# Altium schematic sheet 02_INPUTS.SchDoc
size A3; DocumentNumber: 2; SheetNumber: 2; SheetTotal: 5
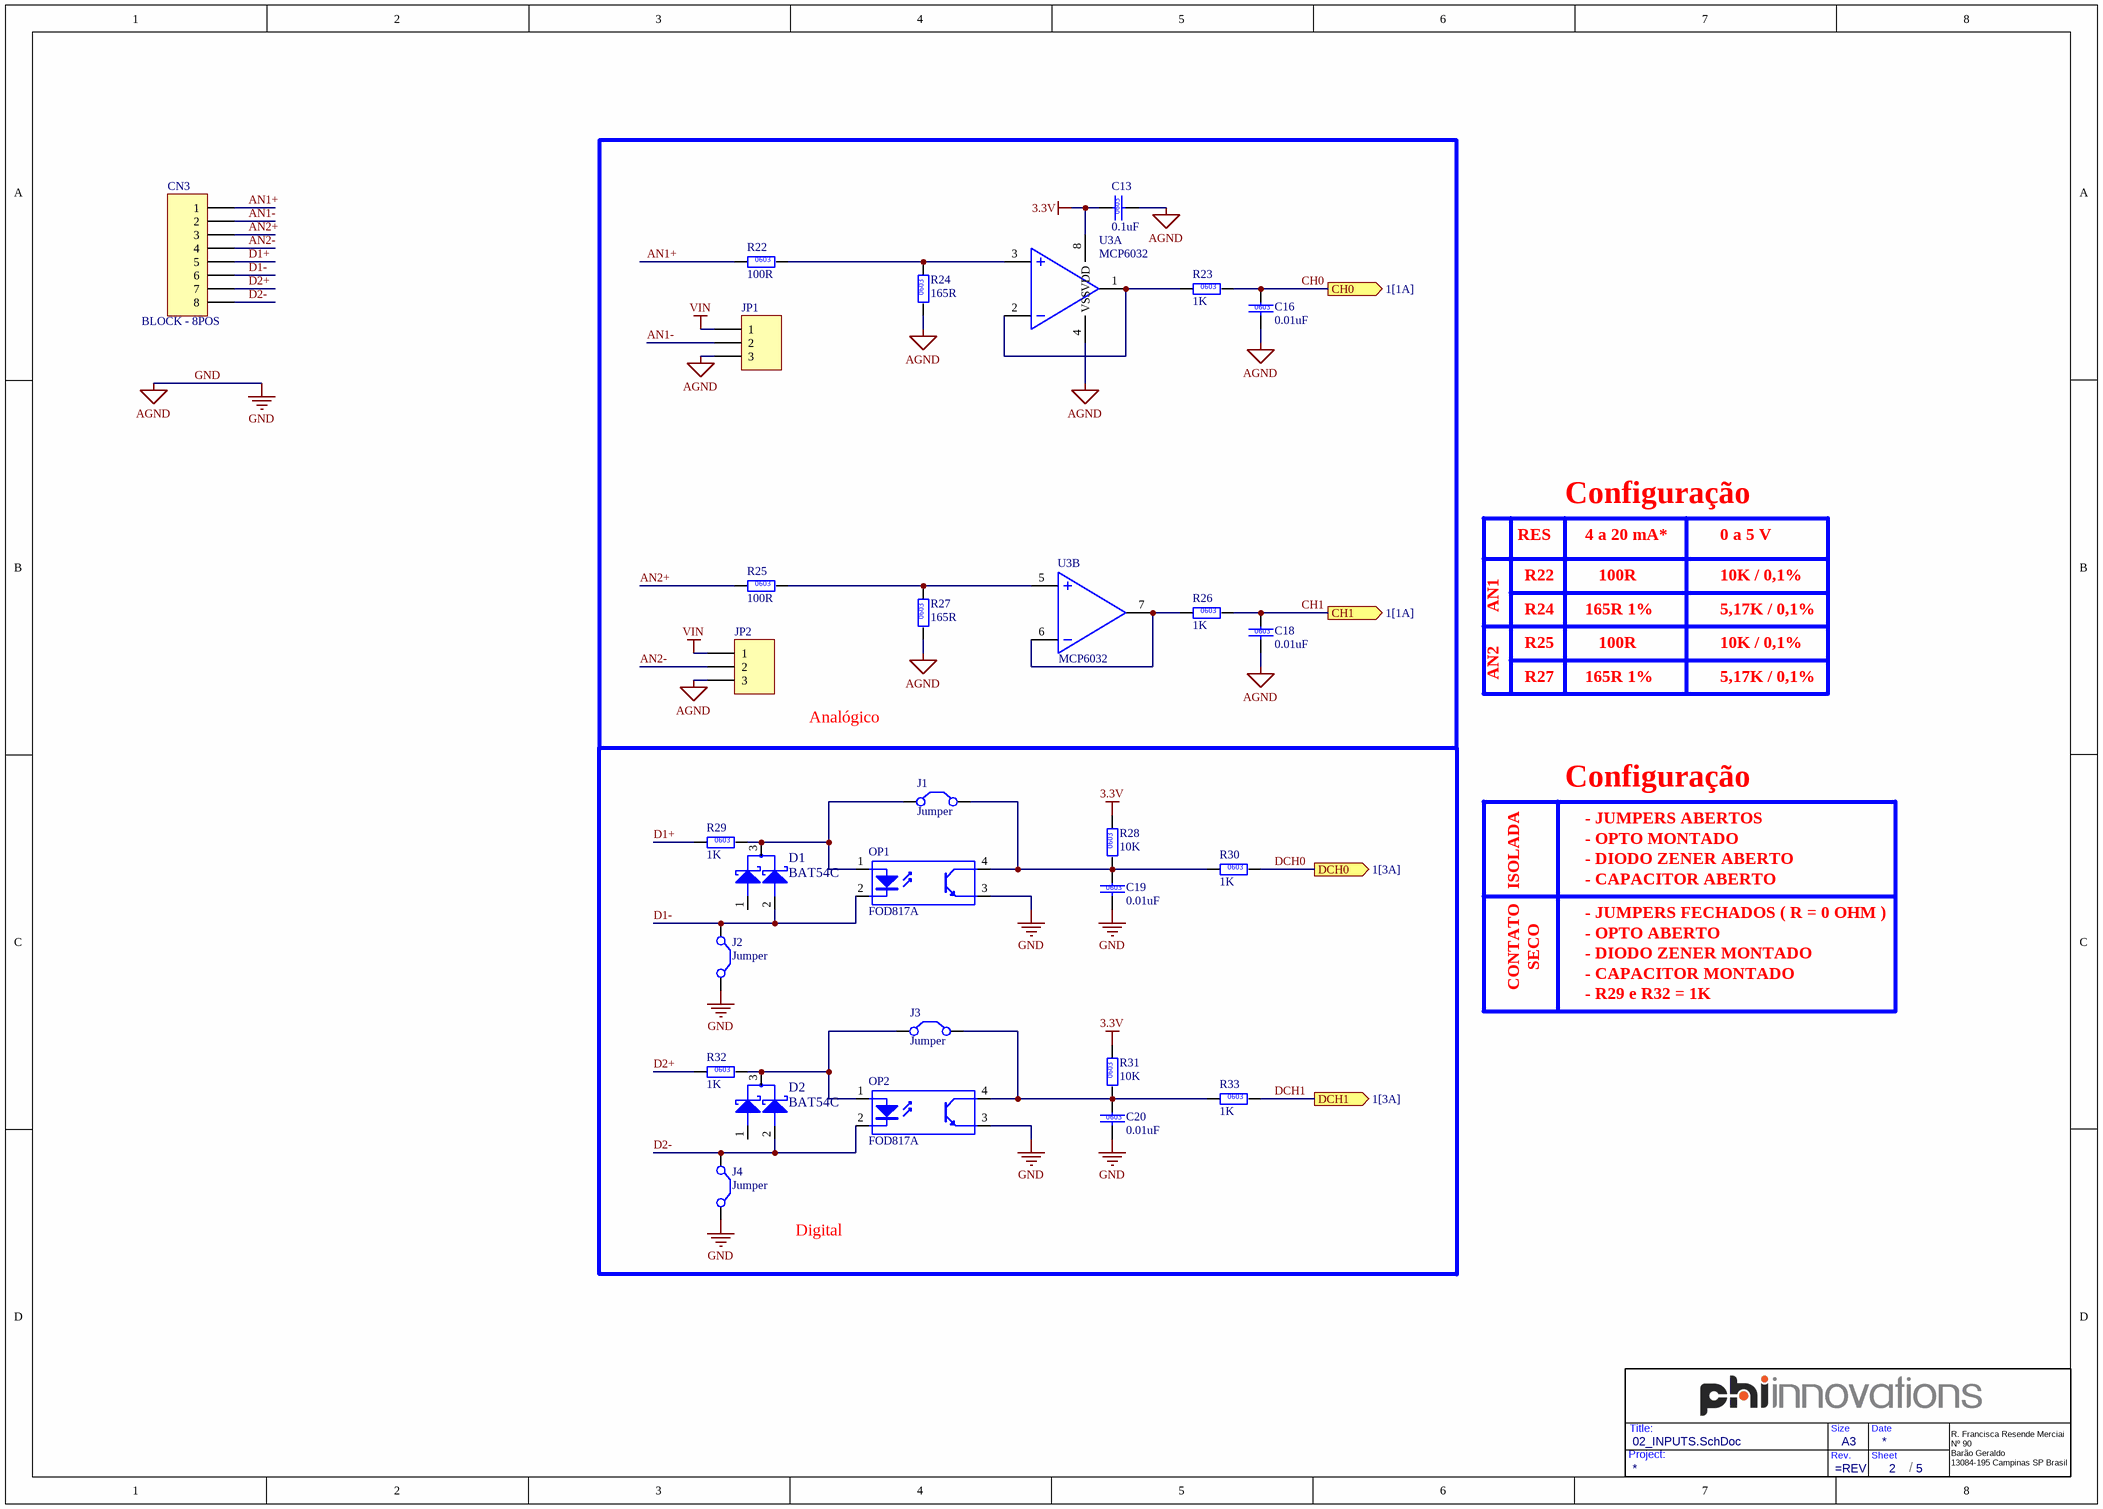
[diagram p0: 02_INPUTS.SchDoc]

## Parts
?  (no value)  (graphical)
C13  0.1uF  [0603C]
C16  0.01uF  [0603C]
C18  0.01uF  [0603C]
C19  0.01uF  [0603C]
C20  0.01uF  [0603C]
CN3  BLOCK - 8POS  [CONN_BORNE_3.81_8POS]
D1  BAT54C  [SOT-23-3]
D2  BAT54C  [SOT-23-3]
J1  Jumper  [HDR1X2]
J2  Jumper  [HDR1X2]
J3  Jumper  [HDR1X2]
J4  Jumper  [HDR1X2]
JP1  (no value)  [HDR1X3]
JP2  (no value)  [HDR1X3]
OP1  FOD817A  [OP SMD]
OP2  FOD817A  [OP SMD]
R22  100R  [0603R]
R23  1K  [0603R]
R24  165R  [0603R]
R25  100R  [0603R]
R26  1K  [0603R]
R27  165R  [0603R]
R28  10K  [0603R]
R29  1K  [0603R]
R30  1K  [0603R]
R31  10K  [0603R]
R32  1K  [0603R]
R33  1K  [0603R]
U3  MCP6032  [SOIC8]  (parts A,B of 2)

## Blocks framed on the sheet
Analógico: C13 C16 C18 JP1 JP2 R22-R27 U3
Digital: C19 C20 D1 D2 J1-J4 OP1 OP2 R28-R33

## Ports
CH0 (out, see 1[1A]), CH1 (out, see 1[1A]), DCH0 (out, see 1[3A]), DCH1 (out, see 1[3A])

## Nets
3.3V: C13.1 R28.2 R31.2 U3.8(VDD)
GND: C13.2 C16.2 C18.2 C19.2 C20.2 J2.2(C2) J4.2(C2) JP1.3 JP2.3 OP1.3(E) OP2.3(E) R24.1 R27.1 U3.4(VSS)  [also labelled AGND]
VIN: JP1.1 JP2.1
AN1+: CN3.1 R22.1
AN1-: CN3.2 JP1.2
AN2+: CN3.3 R25.1
AN2-: CN3.4 JP2.2
CH0: C16.1 R23.2 ; port CH0
CH1: C18.1 R26.2 ; port CH1
D1+: CN3.5 R29.1
D1-: CN3.6 D1.2(ANODE2) J2.1(C1) OP1.2(K)
D2+: CN3.7 R32.1
D2-: CN3.8 D2.2(ANODE2) J4.1(C1) OP2.2(K)
DCH0: R30.2 ; port DCH0
DCH1: R33.2 ; port DCH1
NetC19_1: C19.1 J1.2(C2) OP1.4(C) R28.1 R30.1
NetC20_1: C20.1 J3.2(C2) OP2.4(C) R31.1 R33.1
NetD1_3: D1.3(CATHODE) J1.1(C1) OP1.1(A) R29.2
NetD2_3: D2.3(CATHODE) J3.1(C1) OP2.1(A) R32.2
NetR22_2: R22.2 R24.2 U3.3(VINA+)
NetR23_1: R23.1 U3.1(VOUTA) U3.2(VINA-)
NetR25_2: R25.2 R27.2 U3.5(VINB+)
NetR26_1: R26.1 U3.6(VINB-) U3.7(VOUTB)

Not connected (* = marked no-connect by the designer): D1 1(ANODE1); D2 1(ANODE1)

## Notes on the sheet
- Configuração
- RES
- R22
- 4 a 20 mA*
- 100R
- 0 a 5 V
- 10K / 0,1%
- AN1
- R24
- R25
- 165R 1%
- 5,17K / 0,1%
- AN2
- R27
- - JUMPERS ABERTOS
- - OPTO MONTADO
- ISOLADA
- - DIODO ZENER ABERTO
- - CAPACITOR ABERTO
- - JUMPERS FECHADOS ( R = 0 OHM )
- CONTATO
- SECO
- - OPTO ABERTO
- - DIODO ZENER MONTADO
- - CAPACITOR MONTADO
- - R29 e R32 = 1K
- Project:
- Title:
- Rev.
- Size
- Sheet
- Date
- /
- R. Francisca Resende Merciai
  Nº 90
  Barão Geraldo
  13084-195 Campinas SP Brasil
- (in symbol PHI100.0.0603.100R.001.1/10W) 0603
- (in symbol PHI100.0.0603.165R.001.1/10W) 0603
- (in symbol PHI201.0.0603.000u1.005.050V.X7R) 0603
- (in symbol PHI201.0.0603.00u01.010.050V.X7R) 0603
- (in symbol RES0603) 0603

## Library data of the parts
? = Title_Block3
C13 = PHI201.0.0603.000u1.005.050V.X7R: CAP0603; Partnumber fabricante 1: 06035C104JAT2A; Fabricante 1: AVX Corporation; P Description: Capacitor ceramico 0603 0.1uF 20% 50V X7R; SCH Info: IOs; Datasheet fabricante 1: http://datasheets.avx.com/X7RDielectric.pdf; Distribuidor 1: Digi Key; Distribuidor 2: Mouser; Partnumber PHI: PHI201.0.0603.000u1.005.050V.X7R; PN distribuidor 1 / Fab 1: 478-5778-1-ND; Value: 0.1uF
C16 C18-C20 = PHI201.0.0603.00u01.010.050V.X7R: CAP0603; Partnumber fabricante 1: C0603C103K5RACTU; Fabricante 1: Kemet; P Description: Capacitor ceramico 0603 10000pF 10% 50V X7R; SCH Info: IOs; Partnumber PHI: PHI201.0.0603.00u01.010.050V.X7R; Datasheet fabricante 1: http://www.kemet.com/docfinder?Partnumber=C0603C103K5RACTU; Distribuidor 1: Digi Key; PN distribuidor 1 / Fab 1: 399-1091-1-ND; Distribuidor 2: Mouser; Value: 0.01uF
CN3 = PHI740.1.M.OSTOQ083251: HEADER_8; Fabricante 1: On Shore Technology Inc.; P Description: TERM BLOCK HDR 8POS 90DEG 3.81MM; SCH Info: IOs; Partnumber PHI: PHI740.1.M.OSTOQ083251; Partnumber fabricante 1: OSTOQ083251; Datasheet fabricante 1: http://www.on-shore.com/wp-content/uploads/2015/09/ostoqxx3251.pdf; Distribuidor 1: Digi Key; PN distribuidor 1 / Fab 1: ED2814-ND; Distribuidor 2: Mouser; Value: BLOCK - 8POS
D1 D2 = PHI420.0.BAT54C-7-F: BAT54C-7-F; Fabricante 1: Diodes Incorporated; P Description: Diodo Array Schottky Small Sig SOT-23-3 30V 1 Pair Common Cathode; SCH Info: IOs; Partnumber PHI: PHI420.0.BAT54C-7-F; Partnumber fabricante 1: BAT54C-7-F; Datasheet fabricante 1: http://www.diodes.com/_files/datasheets/ds11005.pdf; Distribuidor 1: Digi Key; PN distribuidor 1 / Fab 1: BAT54C-FDICT-ND; Distribuidor 2: Mouser; Value: BAT54C
J1-J4 = Jumper: Jumper Wire; Partnumber fabricante 1: Header 2.54mm; SCH Info: IOs
JP1 JP2 = Header 3: Header, 3-Pin; Partnumber fabricante 1: Header 2.54mm; SCH Info: IOs
OP1 OP2 = PHI800.0.FOD817A3SD: OPTOISOLATOR 5KV TRANSISTOR 4SMD; Fabricante 1: Fairchild Semiconductor; SCH Info: IOs; Partnumber PHI: PHI800.0.FOD817A3SD; Partnumber fabricante 1: FOD817A3SD; Datasheet fabricante 1: http://www.fairchildsemi.com/datasheets/FO/FOD817A.pdf; Distribuidor 1: Digi Key; PN distribuidor 1 / Fab 1: FOD817A3SDCT-ND; Distribuidor 2: Mouser; P Description: OPTOISOLATOR 5KV TRANSISTOR 4SMD; Value: FOD817A
R22 R25 = PHI100.0.0603.100R.001.1/10W: RES0603; Partnumber fabricante 1: RC0603FR-07100RL; Fabricante 1: Yageo; P Description: Resistor SMD 0603 100R 1% 1/16W; Partnumber PHI: PHI100.0.0603.100R.001.1/10W; Datasheet fabricante 1: http://www.yageo.com.tw/exep/pages/download/literatures/PYu-R_INT-thick_7.pdf; Distribuidor 1: Digi Key; PN distribuidor 1 / Fab 1: 311-100HRCT-ND; Distribuidor 2: Mouser; Value: 100R
R23 R26 R29 R30 R32 R33 = RES0603: Resistor 0603 1K; Part Number: RES_0603_1%_1K; Partnumber fabricante 1: RC0603FR-071KL; Partnumber PHI: PHI100.0.0603.001K.001.1/10W; Fabricante 1: Yageo; P Description: Resistor SMD 0603 1K 1% 1/10W; Fabricante 2: Panasonic Electronic Components; SCH Info: IOs; Supplier 1: Digi-Key; Supplier Part Number 1: 311-1.00KHRCT-ND; Datasheet fabricante 1: http://www.yageo.com/NewPortal/yageodocoutput?fileName=/pdf/R-Chip/PYu-RC_Group_51_RoHS_L_3.pdf; Distribuidor 1: Digi Key; Distribuidor 2: Mouser; PN distribuidor 1 / Fab 1: 311-1.00KHRCT-ND; Value: 1K; Datasheet fabricante 2: http://industrial.panasonic.com/www-cgi/jvcr13pz.cgi?E+PZ+3+AOA0002+ERJ3EKF1001V+7+WW; Partnumber fabricante 2: ERJ-3EKF1001V; PN distribuidor 1 / Fab 2: P1.00KHCT-ND
R24 R27 = PHI100.0.0603.165R.001.1/10W: RES0603; Partnumber fabricante 1: RC0603FR-07165RL; Fabricante 1: Yageo; P Description: Resistor SMD 0603 165R 1% 1/16W; Partnumber PHI: PHI100.0.0603.165R.001.1/10W; Datasheet fabricante 1: http://www.yageo.com.tw/exep/pages/download/literatures/PYu-R_INT-thick_7.pdf; Distribuidor 1: Digi Key; PN distribuidor 1 / Fab 1: 311-165HRCT-ND; Distribuidor 2: Mouser; Value: 165R
R28 R31 = RES0603: Part Number: RES_0603_1%_10k; Partnumber fabricante 1: RC0603FR-0710KL; Partnumber PHI: PHI101.0.0603.010K.001.1/10W; Fabricante 1: Yageo; P Description: Resistor SMD 0603 10K 1% 1/08W; Fabricante 2: Stackpole Electronics Inc; SCH Info: IOs; Supplier 1: Digi-Key; Supplier Part Number 1: 311-10.0KHRCT-ND; Datasheet fabricante 1: http://www.yageo.com/documents/recent/PYu-RC_Group_51_RoHS_L_04.pdf; Distribuidor 1: Digi Key; Distribuidor 2: Mouser; PN distribuidor 1 / Fab 1: 311-10.0KHRCT-ND; Value: 10K; Datasheet fabricante 2: http://www.seielect.com/catalog/SEI-RNCP.pdf; Partnumber fabricante 2: RNCP0603FTD10K0; PN distribuidor 1 / Fab 2: RMCF0603FT10K0CT-ND
U3 = PHI800.0.MCP6032-E/SN: Fabricante 1: Microchip Technology; P Description: IC OPAMP GP 10KHZ RRO 8SOIC; Partnumber PHI: PHI800.0.MCP6032-E/SN; Partnumber fabricante 1: MCP6032-E/SN; Datasheet fabricante 1: http://www.microchip.com/mymicrochip/filehandler.aspx?ddocname=en528763; Distribuidor 1: Digi Key; PN distribuidor 1 / Fab 1: MCP6032-E/SN-ND; Distribuidor 2: Mouser; Value: MCP6032